# EAGLE design CapBank Layout (EAGLE 9.5.2)
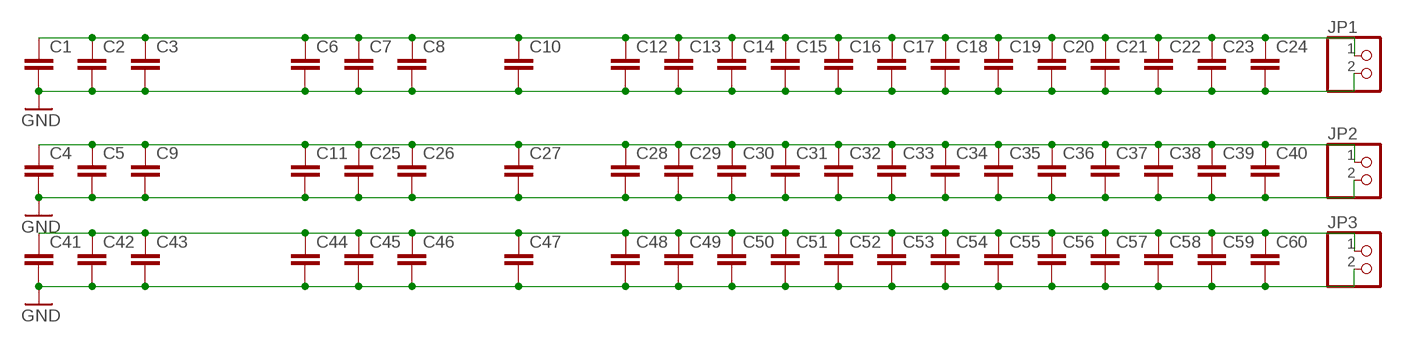
[diagram p0: schematic, sheet 1]

## Parts
C1  C5/5  [C5B5]
C2  C5/5  [C5B5]
C3  C5/5  [C5B5]
C4  C5/5  [C5B5]
C5  C5/5  [C5B5]
C6  C5/5  [C5B5]
C7  C5/5  [C5B5]
C8  C5/5  [C5B5]
C9  C5/5  [C5B5]
C10  C5/5  [C5B5]
C11  C5/5  [C5B5]
C12  C5/5  [C5B5]
C13  C5/5  [C5B5]
C14  C5/5  [C5B5]
C15  C5/5  [C5B5]
C16  C5/5  [C5B5]
C17  C5/5  [C5B5]
C18  C5/5  [C5B5]
C19  C5/5  [C5B5]
C20  C5/5  [C5B5]
C21  C5/5  [C5B5]
C22  C5/5  [C5B5]
C23  C5/5  [C5B5]
C24  C5/5  [C5B5]
C25  C5/5  [C5B5]
C26  C5/5  [C5B5]
C27  C5/5  [C5B5]
C28  C5/5  [C5B5]
C29  C5/5  [C5B5]
C30  C5/5  [C5B5]
C31  C5/5  [C5B5]
C32  C5/5  [C5B5]
C33  C5/5  [C5B5]
C34  C5/5  [C5B5]
C35  C5/5  [C5B5]
C36  C5/5  [C5B5]
C37  C5/5  [C5B5]
C38  C5/5  [C5B5]
C39  C5/5  [C5B5]
C40  C5/5  [C5B5]
C41  C5/5  [C5B5]
C42  C5/5  [C5B5]
C43  C5/5  [C5B5]
C44  C5/5  [C5B5]
C45  C5/5  [C5B5]
C46  C5/5  [C5B5]
C47  C5/5  [C5B5]
C48  C5/5  [C5B5]
C49  C5/5  [C5B5]
C50  C5/5  [C5B5]
C51  C5/5  [C5B5]
C52  C5/5  [C5B5]
C53  C5/5  [C5B5]
C54  C5/5  [C5B5]
C55  C5/5  [C5B5]
C56  C5/5  [C5B5]
C57  C5/5  [C5B5]
C58  C5/5  [C5B5]
C59  C5/5  [C5B5]
C60  C5/5  [C5B5]
JP1  PINHD-1X2/90  [1X02/90]
JP2  PINHD-1X2/90  [1X02/90]
JP3  PINHD-1X2/90  [1X02/90]

## Nets
GND: C1.2 C2.2 C3.2 C4.2 C5.2 C6.2 C7.2 C8.2 C9.2 C10.2 C11.2 C12.2 C13.2 C14.2 C15.2 C16.2 C17.2 C18.2 C19.2 C20.2 C21.2 C22.2 C23.2 C24.2 C25.2 C26.2 C27.2 C28.2 C29.2 C30.2 C31.2 C32.2 C33.2 C34.2 C35.2 C36.2 C37.2 C38.2 C39.2 C40.2 C41.2 C42.2 C43.2 C44.2 C45.2 C46.2 C47.2 C48.2 C49.2 C50.2 C51.2 C52.2 C53.2 C54.2 C55.2 C56.2 C57.2 C58.2 C59.2 C60.2 JP1.2 JP2.2 JP3.2
N$1: C1.1 C2.1 C3.1 C6.1 C7.1 C8.1 C10.1 C12.1 C13.1 C14.1 C15.1 C16.1 C17.1 C18.1 C19.1 C20.1 C21.1 C22.1 C23.1 C24.1 JP1.1
N$2: C4.1 C5.1 C9.1 C11.1 C25.1 C26.1 C27.1 C28.1 C29.1 C30.1 C31.1 C32.1 C33.1 C34.1 C35.1 C36.1 C37.1 C38.1 C39.1 C40.1 JP2.1
N$5: C41.1 C42.1 C43.1 C44.1 C45.1 C46.1 C47.1 C48.1 C49.1 C50.1 C51.1 C52.1 C53.1 C54.1 C55.1 C56.1 C57.1 C58.1 C59.1 C60.1 JP3.1

## Library data of the parts
C1-C60 = capacitor-wima:C: CAPACITOR naming: grid - package width
JP1-JP3 = pinhead:PINHD-1X2: PIN HEADER

## Board
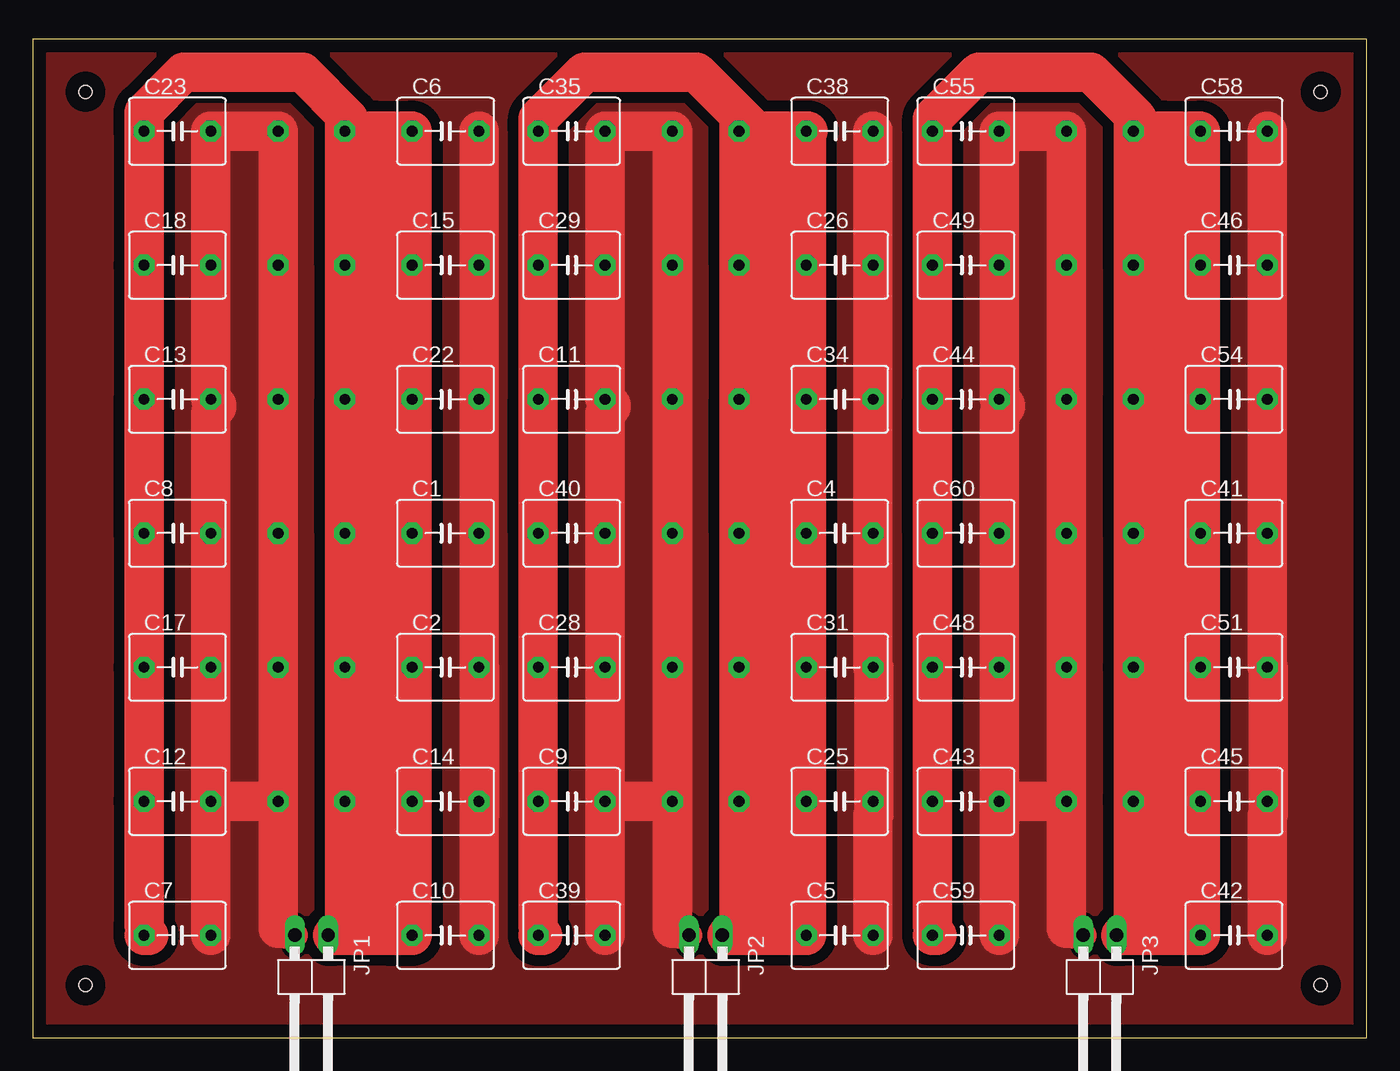
[diagram p1: board, top side]
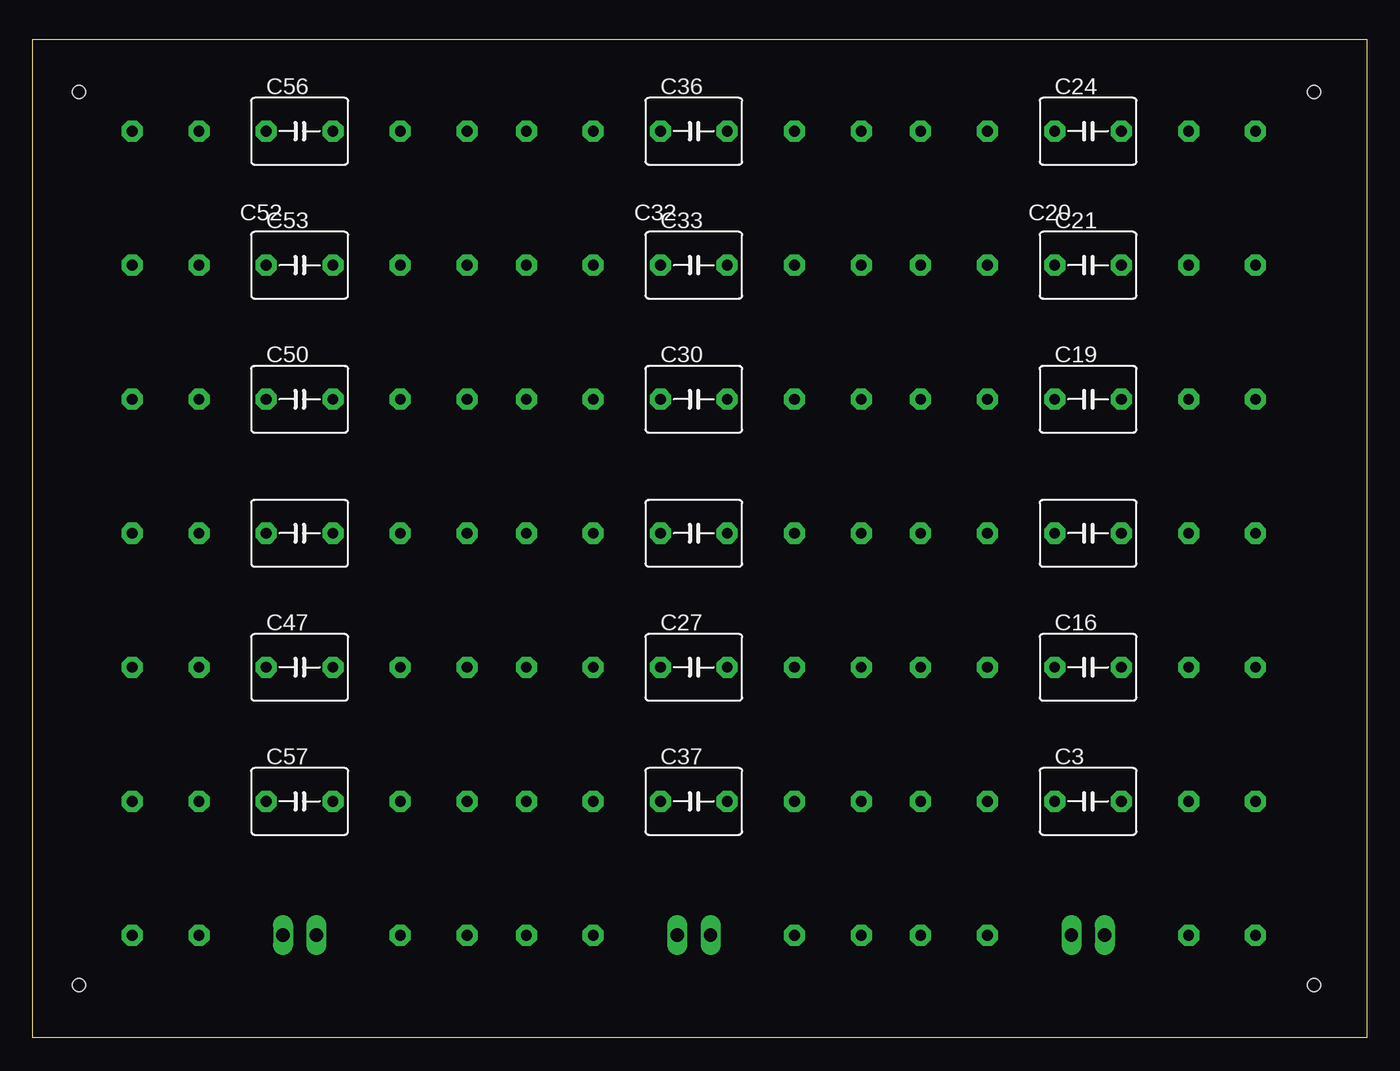
[diagram p2: board, bottom side, seen from below]

Size 101.5 x 76 mm. Coordinates in mm from the lower left corner, seen from the top.
Outline: 0,0 101.5,0 101.5,76 0,76 0,0
Copper layers (1*16): Top 0.035mm / dielectric 1.5mm / Bottom 0.035mm
Design rules "default": minimum track width 6mil, minimum drill 0.35mm, track to track 6mil, track to pad 6mil, pad to pad 6mil, via to via 6mil, smd to smd 6mil, copper to edge 40mil, drill to drill 6mil, minimum pad ring 10mil, minimum via ring 8mil, stop-mask expansion 4mil, vias tented up to drill 0mil, thermal gap 10mil
Holes 1 mm at 4,72 4,4 98,4 98,72

### Footprints (pad centres in the part's own frame; a part is rotated, then mirrored left to right if it is on the bottom)
C5B5 = drill 0.813 pad 1.6 octagon: 1 -2.54,0; 2 2.54,0
1X02/90 = drill 1.016 long: 1 -1.27,-3.81; 2 1.27,-3.81

### Placement (x,y rotation side)
C1  31.4,38.4 0 top
C2  31.4,28.2 0 top
C3  21.2,18 0 bottom
C4  61.4,38.4 0 top
C5  61.4,7.8 0 top
C6  31.4,69 0 top
C7  11,7.8 0 top
C8  11,38.4 0 top
C9  41,18 0 top
C10  31.4,7.8 0 top
C11  41,48.6 0 top
C12  11,18 0 top
C13  11,48.6 0 top
C14  31.4,18 0 top
C15  31.4,58.8 0 top
C16  21.2,28.2 0 bottom
C17  11,28.2 0 top
C18  11,58.8 0 top
C19  21.2,48.6 0 bottom
C20  21.2,38.4 0 bottom
C21  21.2,58.8 0 bottom
C22  31.4,48.6 0 top
C23  11,69 0 top
C24  21.2,69 0 bottom
C25  61.4,18 0 top
C26  61.4,58.8 0 top
C27  51.2,28.2 0 bottom
C28  41,28.2 0 top
C29  41,58.8 0 top
C30  51.2,48.6 0 bottom
C31  61.4,28.2 0 top
C32  51.2,38.4 0 bottom
C33  51.2,58.8 0 bottom
C34  61.4,48.6 0 top
C35  41,69 0 top
C36  51.2,69 0 bottom
C37  51.2,18 0 bottom
C38  61.4,69 0 top
C39  41,7.8 0 top
C40  41,38.4 0 top
C41  91.4,38.4 0 top
C42  91.4,7.8 0 top
C43  71,18 0 top
C44  71,48.6 0 top
C45  91.4,18 0 top
C46  91.4,58.8 0 top
C47  81.2,28.2 0 bottom
C48  71,28.2 0 top
C49  71,58.8 0 top
C50  81.2,48.6 0 bottom
C51  91.4,28.2 0 top
C52  81.2,38.4 0 bottom
C53  81.2,58.8 0 bottom
C54  91.4,48.6 0 top
C55  71,69 0 top
C56  81.2,69 0 bottom
C57  81.2,18 0 bottom
C58  91.4,69 0 top
C59  71,7.8 0 top
C60  71,38.4 0 top
JP1  21.2,4 180 top
JP2  51.2,4 180 top
JP3  81.2,4 180 top

### Tracks (layer width: path | path; a pad name or v marks a point on that pad's centre or on a via)
GND
  Top 2: JP3.2 79.19,7.81 78.66,8.34 | JP2.2 49.19,7.81 48.66,8.34 | JP1.2 19.19,7.81 18.66,8.34
  Top 3: C59.2 C43.2 | C43.2 C48.2 C60.2 73.54,47.54 74,48 74,48.14 C44.2 C49.2 C55.2 C56.2 C53.2 C50.2 C52.2 C47.2 C57.2 | C57.2 C43.2 | C57.2 78.66,8.34 | C42.2 93.94,16.94 94,17 94,28.14 C51.2 C41.2 C54.2 C46.2 C58.2 | C39.2 C9.2 | C9.2 C28.2 C40.2 43.54,47.54 44,48 44,48.14 C11.2 C29.2 C35.2 C36.2 C33.2 C30.2 C32.2 C27.2 C37.2 | C37.2 C9.2 | C37.2 48.66,8.34 | C5.2 63.94,16.94 64,17 64,28.14 C31.2 C4.2 C34.2 C26.2 C38.2 | C7.2 C12.2 | C12.2 C17.2 C8.2 13.54,47.54 14,48 14,48.14 C13.2 C18.2 C23.2 C24.2 C21.2 C19.2 C20.2 C16.2 C3.2 | C3.2 C12.2 | C3.2 18.66,8.34 | C10.2 33.94,16.94 34,17 34,28.14 C2.2 C1.2 C22.2 C15.2 C6.2
  pour Top (isolate 0.813): 0,0 0,76 101,76 101,0
N$1
  Top 2: 8.46,8.54 9,8 8.8,7.8 | C21.1 C24.1 | JP1.1 22.81,7.81 23.74,8.74 | C3.1 23.74,18.26
  Top 3: 8.46,8.54 C12.1 C17.1 C8.1 C13.1 C18.1 C23.1 8.46,70.46 11.48,73.48 20.52,73.48 24,70 | 24,18 C3.1 23.74,8.74 | 24,18 C14.1 | C14.1 C10.1 | C14.1 C2.1 C1.1 C22.1 C15.1 C6.1 26,69 | 24,18 23.74,18.26 C16.1 C20.1 C19.1 C21.1 23.74,69.74 24,70 | 24,70 24,69.26 C24.1 26,69 | 26,69 26,9 27.2,7.8 C10.1 | C10.1 22.82,7.8 22.81,7.81 | C7.1 8.8,7.8
N$2
  Top 2: 38.46,8.54 39,8 38.8,7.8 | JP2.1 52.81,7.81 53.74,8.74 | C36.1 55,69 C38.1 | C37.1 53.74,18.26
  Top 3: 38.46,8.54 C9.1 C28.1 C40.1 C11.1 C29.1 C35.1 38.46,69.94 42,73.48 50.52,73.48 54,70 | 54,18 C37.1 53.74,8.74 | 54,18 56,18 | 56,18 C25.1 | C25.1 C5.1 | C25.1 C31.1 | C31.1 C4.1 C34.1 C26.1 C38.1 | C27.1 C32.1 C30.1 C33.1 53.74,69.74 54,70 | C27.1 53.74,18.26 54,18 | 54,70 55,69 | C38.1 59,69 58.86,68.86 | C38.1 C36.1 | C27.1 56,28.2 | C31.1 56,28.2 | 56,28.2 56,18 | 56,28.2 56,68 57,69 C38.1 | C5.1 57.66,9 56,9 56,18 | C5.1 52.82,7.8 52.81,7.81 | C39.1 38.8,7.8
N$5
  Top 2: 68.46,8.54 69,8 68.8,7.8 | JP3.1 82.81,7.81 83.74,8.74 | C57.1 83.74,18.26
  Top 3: 68.46,8.54 C43.1 C48.1 C60.1 C44.1 C49.1 C55.1 68.46,69.94 72,73.48 80.52,73.48 84,70 83.74,69.74 C56.1 | 84,18 C57.1 83.74,8.74 | 84,18 C45.1 | C45.1 C42.1 | C45.1 C51.1 C41.1 C54.1 C46.1 C58.1 86,69 | 84,18 83.74,18.26 C47.1 C52.1 C50.1 C53.1 C56.1 | C56.1 86,69 | 86,69 86,8 86.2,7.8 C42.1 | C42.1 82.82,7.8 82.81,7.81 | C59.1 68.8,7.8